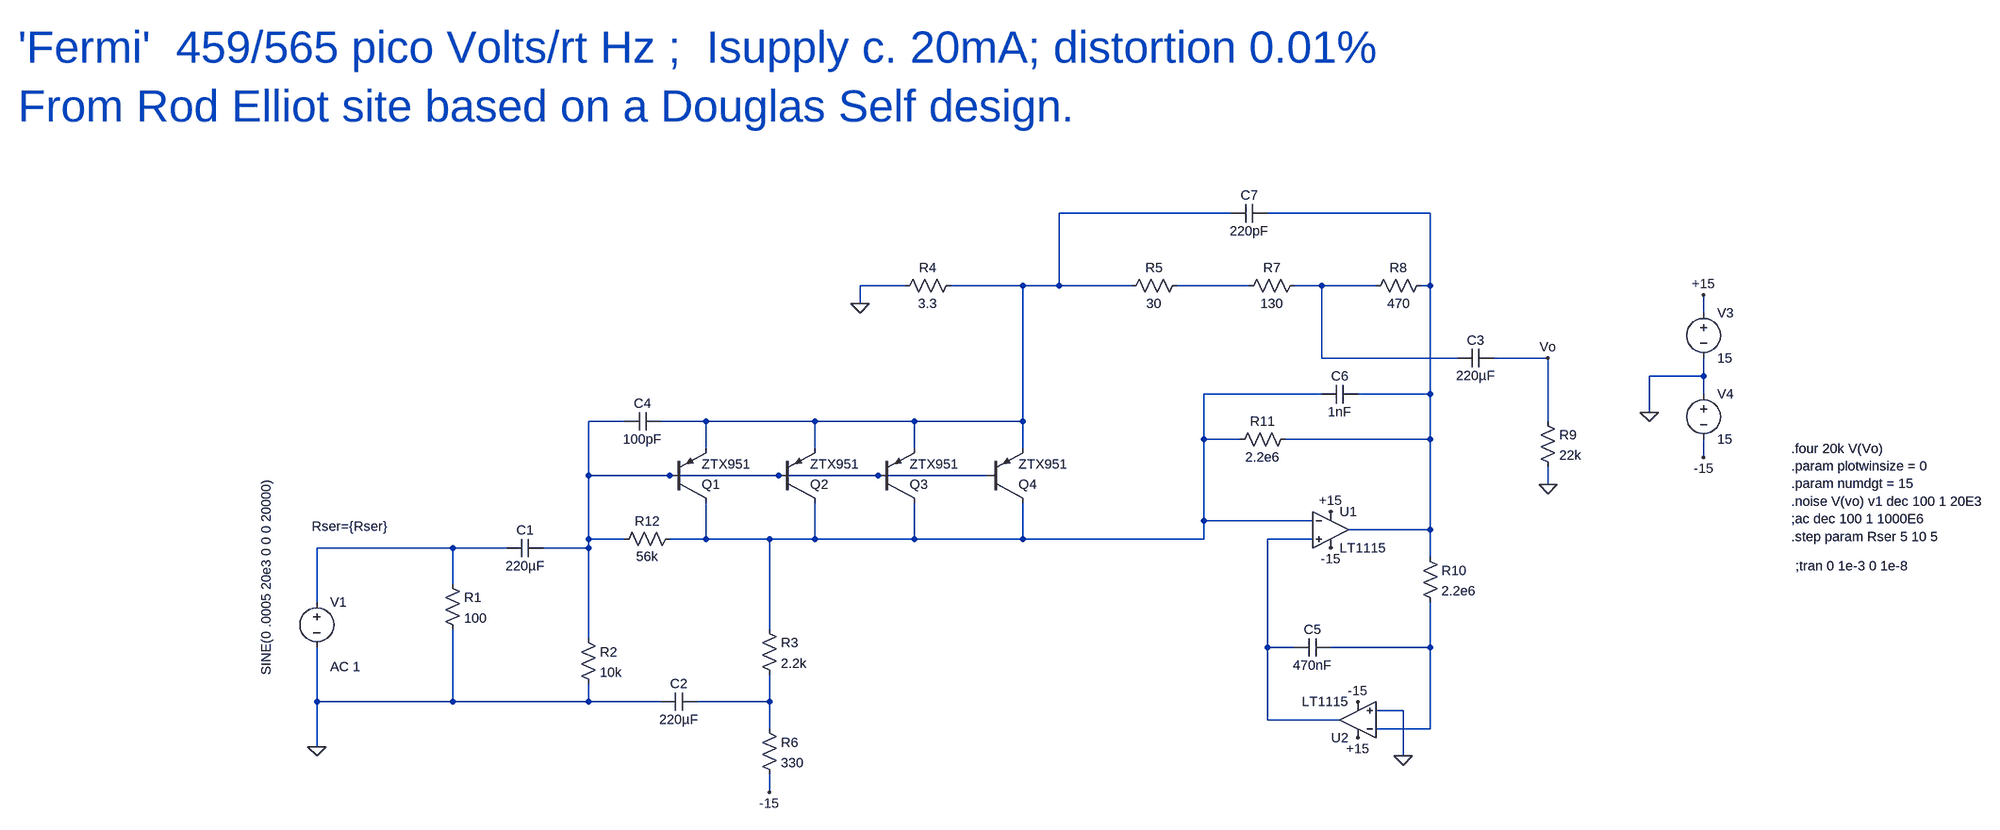
[diagram p0: schematic Fermi.asc]
Fermi.asc, the LTspice schematic file:
Version 4
SHEET 1 3296 680
WIRE 1552 -448 1248 -448
WIRE 1904 -448 1616 -448
WIRE 976 -320 896 -320
WIRE 1184 -320 1056 -320
WIRE 1248 -320 1248 -448
WIRE 1248 -320 1184 -320
WIRE 1376 -320 1248 -320
WIRE 1584 -320 1456 -320
WIRE 1712 -320 1664 -320
WIRE 1808 -320 1712 -320
WIRE 1904 -320 1904 -448
WIRE 1904 -320 1888 -320
WIRE 896 -288 896 -320
WIRE 2512 -272 2512 -304
WIRE 1712 -192 1712 -320
WIRE 1952 -192 1712 -192
WIRE 2112 -192 2016 -192
WIRE 2512 -160 2512 -192
WIRE 2512 -160 2416 -160
WIRE 1712 -128 1504 -128
WIRE 1904 -128 1904 -320
WIRE 1904 -128 1776 -128
WIRE 2512 -128 2512 -160
WIRE 2416 -96 2416 -160
WIRE 480 -80 416 -80
WIRE 624 -80 544 -80
WIRE 816 -80 624 -80
WIRE 992 -80 816 -80
WIRE 1184 -80 1184 -320
WIRE 1184 -80 992 -80
WIRE 2112 -80 2112 -192
WIRE 1504 -48 1504 -128
WIRE 1568 -48 1504 -48
WIRE 1904 -48 1904 -128
WIRE 1904 -48 1648 -48
WIRE 624 -32 624 -80
WIRE 816 -32 816 -80
WIRE 992 -32 992 -80
WIRE 1184 -32 1184 -80
WIRE 2512 -16 2512 -48
WIRE 416 16 416 -80
WIRE 560 16 416 16
WIRE 752 16 560 16
WIRE 928 16 752 16
WIRE 1120 16 928 16
WIRE 2112 32 2112 0
WIRE 1504 96 1504 -48
WIRE 1696 96 1504 96
WIRE 1904 112 1904 -48
WIRE 1904 112 1760 112
WIRE 416 128 416 16
WIRE 480 128 416 128
WIRE 624 128 624 64
WIRE 624 128 560 128
WIRE 736 128 624 128
WIRE 816 128 816 64
WIRE 816 128 736 128
WIRE 992 128 992 64
WIRE 992 128 816 128
WIRE 1184 128 1184 64
WIRE 1184 128 992 128
WIRE 1504 128 1504 96
WIRE 1504 128 1184 128
WIRE 1696 128 1616 128
WIRE 176 144 -64 144
WIRE 272 144 176 144
WIRE 416 144 416 128
WIRE 416 144 336 144
WIRE 1904 160 1904 112
WIRE 176 208 176 144
WIRE -64 240 -64 144
WIRE 736 288 736 128
WIRE 416 304 416 144
WIRE 1616 320 1616 128
WIRE 1664 320 1616 320
WIRE 1904 320 1904 240
WIRE 1904 320 1728 320
WIRE -64 416 -64 320
WIRE 176 416 176 288
WIRE 176 416 -64 416
WIRE 416 416 416 384
WIRE 416 416 176 416
WIRE 544 416 416 416
WIRE 736 416 736 368
WIRE 736 416 608 416
WIRE 1856 432 1808 432
WIRE 1616 448 1616 320
WIRE 1744 448 1616 448
WIRE 736 464 736 416
WIRE 1904 464 1904 320
WIRE 1904 464 1808 464
WIRE -64 496 -64 416
WIRE 1856 512 1856 432
WIRE 736 576 736 544
FLAG -64 496 0
FLAG 2416 -96 0
FLAG 2512 -304 +15
FLAG 2512 -16 -15
FLAG 1728 144 -15
FLAG 1728 80 +15
FLAG 896 -288 0
FLAG 736 576 -15
FLAG 2112 32 0
FLAG 2112 -192 Vo
FLAG 1776 416 -15
FLAG 1776 480 +15
FLAG 1856 512 0
SYMBOL voltage -64 224 R0
WINDOW 3 -89 -203 VRight 2
WINDOW 123 24 130 Left 2
WINDOW 39 -9 -118 Left 2
SYMATTR Value SINE(0 .0005 20e3 0 0 0 20000)
SYMATTR Value2 AC 1
SYMATTR SpiceLine Rser={Rser}
SYMATTR InstName V1
SYMBOL Opamps\\LT1115 1728 48 R0
SYMATTR InstName U1
SYMBOL voltage 2512 -288 R0
WINDOW 123 0 0 Left 2
WINDOW 39 0 0 Left 2
SYMATTR InstName V3
SYMATTR Value 15
SYMBOL voltage 2512 -144 R0
WINDOW 123 0 0 Left 2
WINDOW 39 0 0 Left 2
SYMATTR InstName V4
SYMATTR Value 15
SYMBOL res 160 192 R0
SYMATTR InstName R1
SYMATTR Value 100
SYMBOL res 400 288 R0
SYMATTR InstName R2
SYMATTR Value 10k
SYMBOL cap 272 128 M90
WINDOW 0 0 32 VBottom 2
WINDOW 3 32 32 VTop 2
SYMATTR InstName C1
SYMATTR Value 220µF
SYMBOL pnp 560 64 M180
SYMATTR InstName Q1
SYMATTR Value ZTX951
SYMBOL pnp 752 64 M180
SYMATTR InstName Q2
SYMATTR Value ZTX951
SYMBOL pnp 928 64 M180
SYMATTR InstName Q3
SYMATTR Value ZTX951
SYMBOL pnp 1120 64 M180
SYMATTR InstName Q4
SYMATTR Value ZTX951
SYMBOL res 720 272 R0
SYMATTR InstName R3
SYMATTR Value 2.2k
SYMBOL res 720 448 R0
SYMATTR InstName R6
SYMATTR Value 330
SYMBOL cap 544 400 M90
WINDOW 0 0 32 VBottom 2
WINDOW 3 32 32 VTop 2
SYMATTR InstName C2
SYMATTR Value 220µF
SYMBOL res 1072 -336 R90
WINDOW 0 0 56 VBottom 2
WINDOW 3 32 56 VTop 2
SYMATTR InstName R4
SYMATTR Value 3.3
SYMBOL res 1472 -336 R90
WINDOW 0 0 56 VBottom 2
WINDOW 3 32 56 VTop 2
SYMATTR InstName R5
SYMATTR Value 30
SYMBOL res 1680 -336 R90
WINDOW 0 0 56 VBottom 2
WINDOW 3 32 56 VTop 2
SYMATTR InstName R7
SYMATTR Value 130
SYMBOL res 1904 -336 R90
WINDOW 0 0 56 VBottom 2
WINDOW 3 32 56 VTop 2
SYMATTR InstName R8
SYMATTR Value 470
SYMBOL cap 1952 -208 M90
WINDOW 0 0 32 VBottom 2
WINDOW 3 32 32 VTop 2
SYMATTR InstName C3
SYMATTR Value 220µF
SYMBOL res 2096 -96 R0
SYMATTR InstName R9
SYMATTR Value 22k
SYMBOL cap 544 -96 R90
WINDOW 0 0 32 VBottom 2
WINDOW 3 32 32 VTop 2
SYMATTR InstName C4
SYMATTR Value 100pF
SYMBOL Opamps\\LT1115 1776 512 R180
SYMATTR InstName U2
SYMBOL res 1888 144 R0
SYMATTR InstName R10
SYMATTR Value 2.2e6
SYMBOL cap 1728 304 R90
WINDOW 0 0 32 VBottom 2
WINDOW 3 32 32 VTop 2
SYMATTR InstName C5
SYMATTR Value 470nF
SYMBOL res 1664 -64 R90
WINDOW 0 0 56 VBottom 2
WINDOW 3 32 56 VTop 2
SYMATTR InstName R11
SYMATTR Value 2.2e6
SYMBOL cap 1776 -144 R90
WINDOW 0 0 32 VBottom 2
WINDOW 3 32 32 VTop 2
SYMATTR InstName C6
SYMATTR Value 1nF
SYMBOL cap 1616 -464 R90
WINDOW 0 0 32 VBottom 2
WINDOW 3 32 32 VTop 2
SYMATTR InstName C7
SYMATTR Value 220pF
SYMBOL res 576 112 R90
WINDOW 0 0 56 VBottom 2
WINDOW 3 32 56 VTop 2
SYMATTR InstName R12
SYMATTR Value 56k
TEXT 2720 176 Left 2 !;tran 0 1e-3 0 1e-8
TEXT 2712 -32 Left 2 !.four 20k V(Vo)\n.param plotwinsize = 0\n.param numdgt = 15\n.noise V(vo) v1 dec 100 1 20E3\n;ac dec 100 1 1000E6\n.step param Rser 5 10 5
TEXT -592 -928 Left 6 ;'Fermi'  459/565 pico Volts/rt Hz ;  Isupply c. 20mA; distortion 0.01%\nFrom Rod Elliot site based on a Douglas Self design.

The netlist it stands for:
* Fermi.asc
V1 N008 0 SINE(0 .0005 20e3 0 0 0 20000) AC 1 Rser={Rser}
XU1 N007 N005 +15 -15 N002 LT1028  ; LT1115, pins In+ In- V+ V- OUT
V3 +15 0 15
V4 0 -15 15
R1 N008 0 100
R2 N006 0 10k
C1 N008 N006 220µF
Q1 N005 N006 N001 0 ZTX951
Q2 N005 N006 N001 0 ZTX951
Q3 N005 N006 N001 0 ZTX951
Q4 N005 N006 N001 0 ZTX951
R3 N005 N010 2.2k
R6 N010 -15 330
C2 0 N010 220µF
R4 N001 0 3.3
R5 N003 N001 30
R7 N004 N003 130
R8 N002 N004 470
C3 N004 Vo 220µF
R9 Vo 0 22k
C4 N001 N006 100pF
XU2 0 N009 +15 -15 N007 LT1028  ; LT1115, pins In+ In- V+ V- OUT
R10 N002 N009 2.2e6
C5 N009 N007 470nF
R11 N002 N005 2.2e6
C6 N002 N005 1nF
C7 N002 N001 220pF
R12 N005 N006 56k
.model NPN NPN
.model PNP PNP
.lib standard.bjt
;tran 0 1e-3 0 1e-8
.four 20k V(Vo)
.param plotwinsize = 0
.param numdgt = 15
.noise V(vo) v1 dec 100 1 20E3
;ac dec 100 1 1000E6
.step param Rser 5 10 5
* 'Fermi'  459/565 pico Volts/rt Hz ;  Isupply c. 20mA; distortion 0.01%
* From Rod Elliot site based on a Douglas Self design.
.lib LTC.lib
.backanno
.end